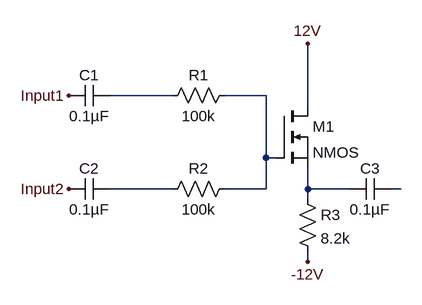
[diagram p0: schematic Mixer_Circuit.asc]
Mixer_Circuit.asc, the LTspice schematic file:
Version 4
SHEET 1 880 680
WIRE 144 96 48 96
WIRE 288 96 224 96
WIRE 352 112 352 16
WIRE 288 192 288 96
WIRE 304 192 288 192
WIRE 144 240 48 240
WIRE 288 240 288 192
WIRE 288 240 224 240
WIRE 352 240 352 208
WIRE 416 240 352 240
WIRE 496 240 480 240
WIRE 352 256 352 240
WIRE 352 352 352 336
FLAG 352 352 -12V
FLAG 352 16 12V
FLAG -16 96 Input1
FLAG -16 240 Input2
SYMBOL cap 48 80 R90
WINDOW 0 0 32 VBottom 2
WINDOW 3 32 32 VTop 2
SYMATTR InstName C1
SYMATTR Value 0.1µF
SYMBOL cap 48 224 R90
WINDOW 0 0 32 VBottom 2
WINDOW 3 32 32 VTop 2
SYMATTR InstName C2
SYMATTR Value 0.1µF
SYMBOL res 240 80 R90
WINDOW 0 0 56 VBottom 2
WINDOW 3 32 56 VTop 2
SYMATTR InstName R1
SYMATTR Value 100k
SYMBOL res 240 224 R90
WINDOW 0 0 56 VBottom 2
WINDOW 3 32 56 VTop 2
SYMATTR InstName R2
SYMATTR Value 100k
SYMBOL nmos 304 112 R0
SYMATTR InstName M1
SYMBOL res 336 240 R0
SYMATTR InstName R3
SYMATTR Value 8.2k
SYMBOL cap 480 224 R90
WINDOW 0 0 32 VBottom 2
WINDOW 3 32 32 VTop 2
SYMATTR InstName C3
SYMATTR Value 0.1µF

The netlist it stands for:
* Mixer_Circuit.asc
C1 N001 Input1 0.1µF
C2 N003 Input2 0.1µF
R1 N002 N001 100k
R2 N002 N003 100k
M1 12V N002 N004 N004 NMOS
R3 N004 -12V 8.2k
C3 N005 N004 0.1µF
.model NMOS NMOS
.model PMOS PMOS
.lib standard.mos
.backanno
.end